# EAGLE schematic modular_expansion_system_graphics_and_sound (EAGLE 9.2.1)
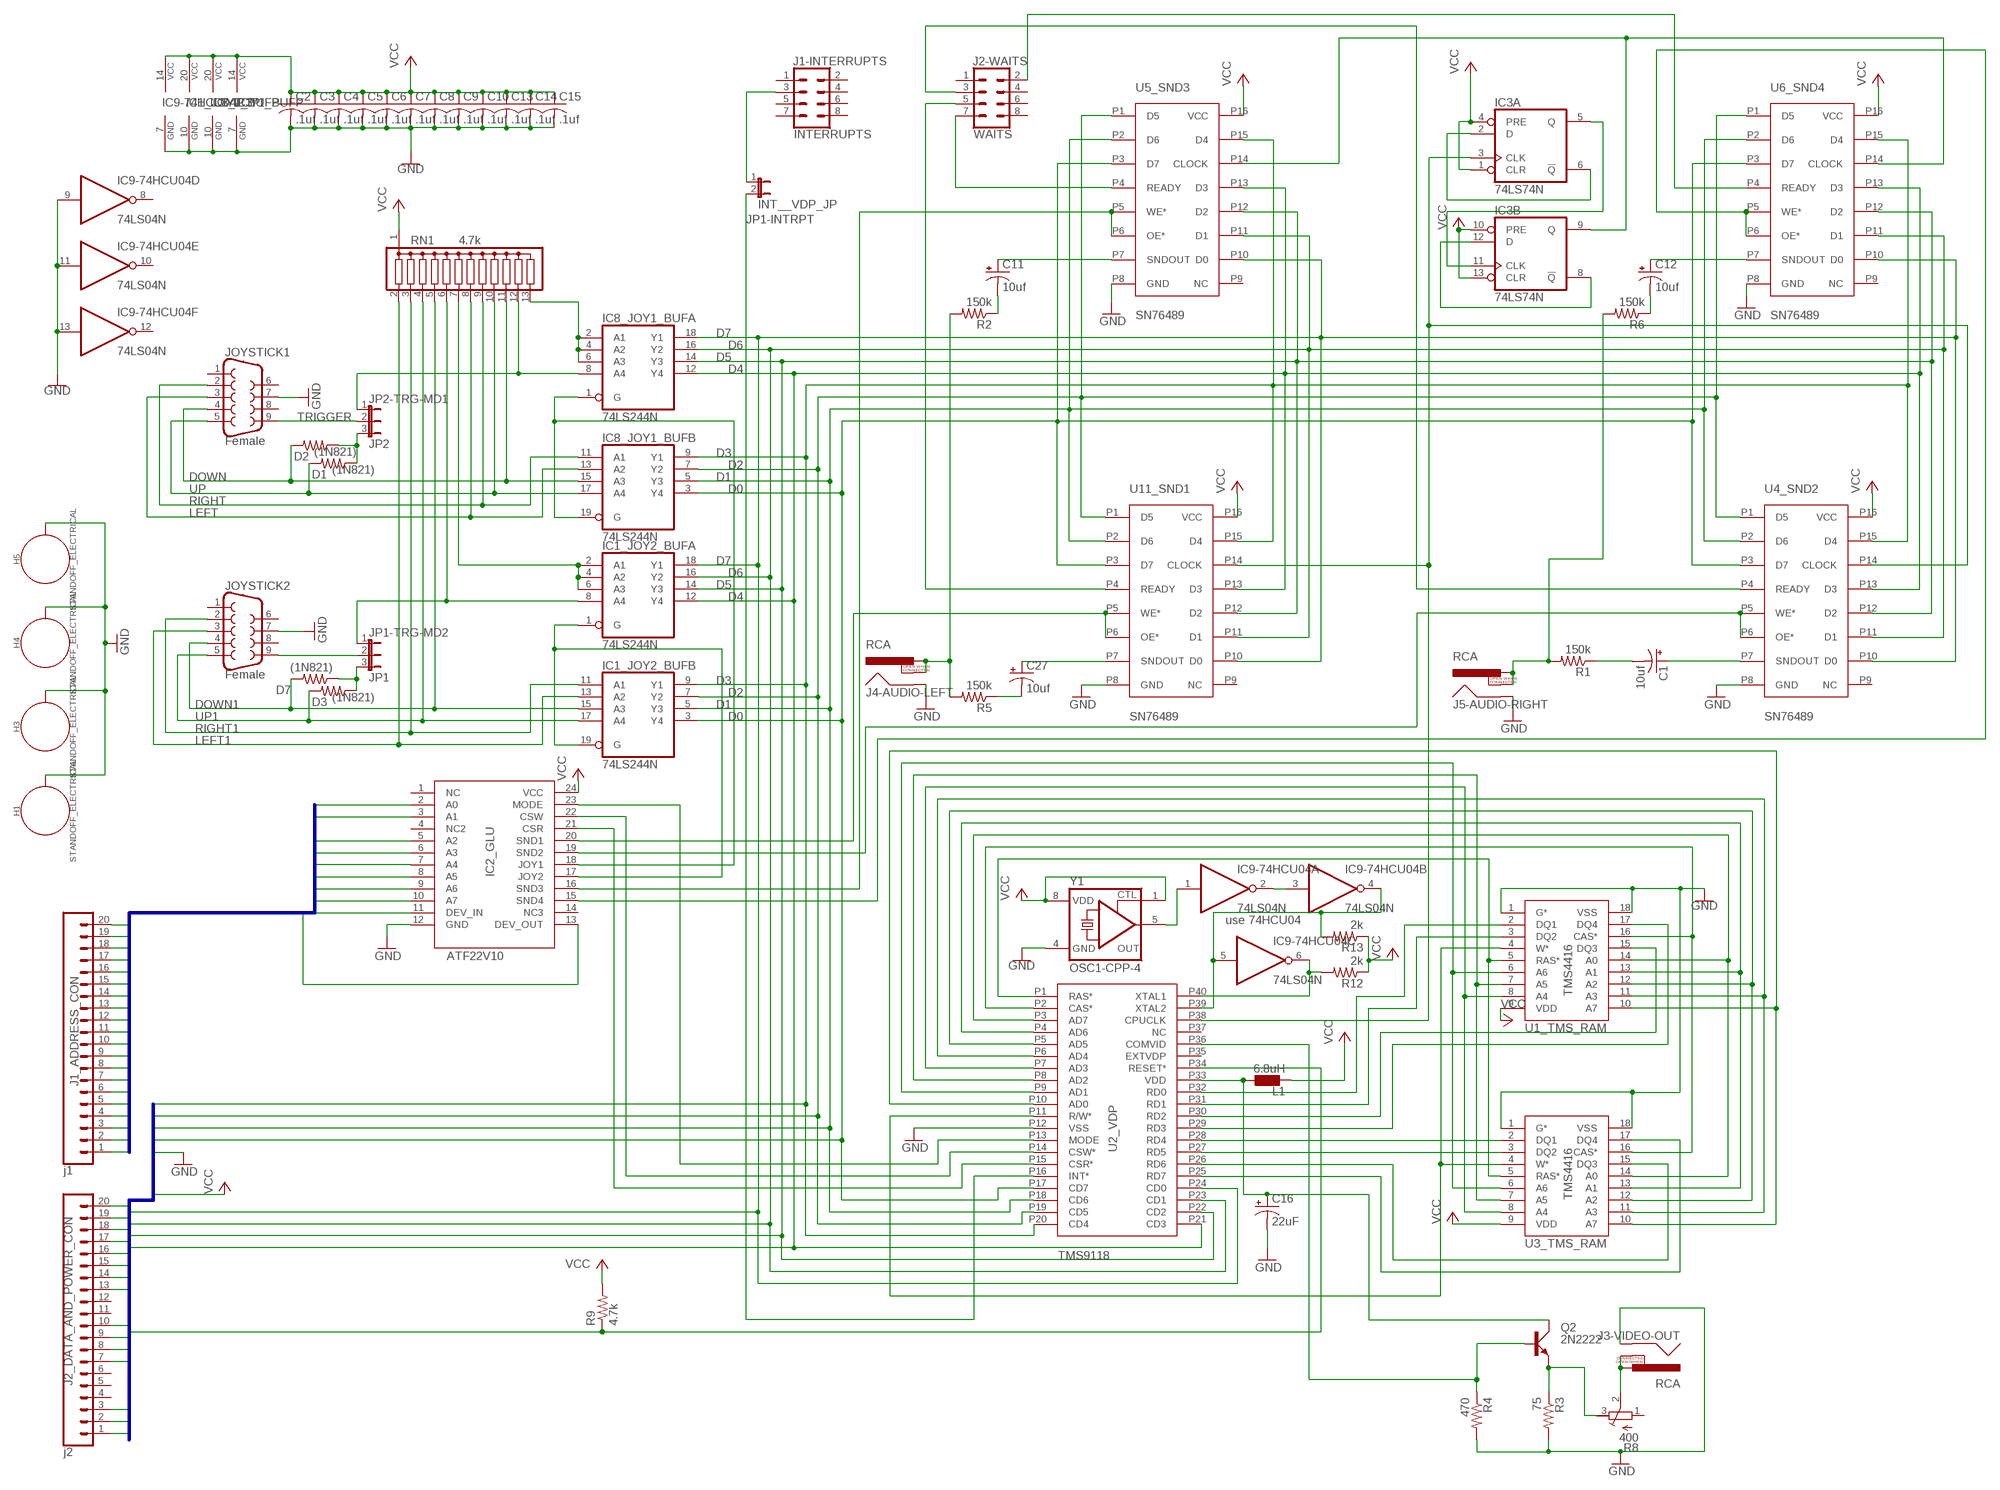
[diagram p0: schematic, sheet 1]

## Parts
C1  10uf  CPOL-USE2.5-6  [E2,5-6]
C2  .1uf  C-US025-024X044  [C025-024X044]
C3  .1uf  C-US025-024X044  [C025-024X044]
C4  .1uf  C-US025-024X044  [C025-024X044]
C5  .1uf  C-US025-024X044  [C025-024X044]
C6  .1uf  C-US025-024X044  [C025-024X044]
C7  .1uf  C-US025-024X044  [C025-024X044]
C8  .1uf  C-US025-024X044  [C025-024X044]
C9  .1uf  C-US025-024X044  [C025-024X044]
C10  .1uf  C-US025-024X044  [C025-024X044]
C11  10uf  CPOL-USE2.5-6  [E2,5-6]
C12  10uf  CPOL-USE2.5-6  [E2,5-6]
C13  .1uf  C-US025-024X044  [C025-024X044]
C14  .1uf  C-US025-024X044  [C025-024X044]
C15  .1uf  C-US025-024X044  [C025-024X044]
C16  22uF  CPOL-USE2.5-5  [E2,5-5]
C27  10uf  CPOL-USE2.5-6  [E2,5-6]
D1  (1N821)  R-US_0204/2V  [0204V]
D2  (1N821)  R-US_0204/2V  [0204V]
D3  (1N821)  R-US_0204/2V  [0204V]
D7  (1N821)  R-US_0204/2V  [0204V]
H1  STANDOFF_ELECTRICAL  [STANDOFF-ELECTRICAL]
H3  STANDOFF_ELECTRICAL  [STANDOFF-ELECTRICAL]
H4  STANDOFF_ELECTRICAL  [STANDOFF-ELECTRICAL]
H5  STANDOFF_ELECTRICAL  [STANDOFF-ELECTRICAL]
IC1_JOY2_BUF  74LS244N  [DIL20]
IC2_GLU  ATF22V10  TRS80MXS_DECODER  [DIP24SKI]
IC3  74LS74N  [DIL14]
IC8_JOY1_BUF  74LS244N  [DIL20]
IC9-74HCU04  74LS04N  [DIL14]
J1-INTERRUPTS  INTERRUPTS  CONN_04X2  [2X4]
J1_ADDRESS_CON  j1  CONN_20  [1X20]
J2-WAITS  WAITS  CONN_04X2  [2X4]
J2_DATA_AND_POWER_CON  j2  CONN_20  [1X20]
J3-VIDEO-OUT  RCA  [RCA]
J4-AUDIO-LEFT  RCA  [RCA]
J5-AUDIO-RIGHT  RCA  [RCA]
JOYSTICK1  Female  DB9FEMALE  [DB9]
JOYSTICK2  Female  DB9FEMALE  [DB9]
JP1-INTRPT  INT__VDP_JP  JP1E  [JP1]
JP1-TRG-MD2  JP1  JP2E  [JP2]
JP2-TRG-MD1  JP2  JP2E  [JP2]
L1  6.8uH  L0207/10  [0207/10]
Q2  2N2222  [TO18A]
R1  150k  R-US_0207/2V  [0207/2V]
R2  150k  R-US_0207/2V  [0207/2V]
R3  75  R-US_0207/2V  [0207/2V]
R4  470  R-US_0207/2V  [0207/2V]
R5  150k  R-US_0207/2V  [0207/2V]
R6  150k  R-US_0207/2V  [0207/2V]
R8  400  R-TRIMM64W  [RTRIM64W]
R9  4.7k  R-US_0207/2V  [0207/2V]
R12  2k  R-US_0207/2V  [0207/2V]
R13  2k  R-US_0207/2V  [0207/2V]
RN1  4.7k  G12R  [SIL13]
U1_TMS_RAM  TMS4416  [DIP18]
U2_VDP  TMS9118  [DIP40_MCU]
U3_TMS_RAM  TMS4416  [DIP18]
U4_SND2  SN76489  [DIP16]
U5_SND3  SN76489  [DIP16]
U6_SND4  SN76489  [DIP16]
U11_SND1  SN76489  [DIP16]
Y1  OSC1-CPP-4  [CPP-4]

## Nets
5_BIT_TRIGGER_LINE: IC8_JOY1_BUF.8(A:A4) JP2-TRG-MD1.1 RN1.12
5_BIT_TRIGGER_LINE_2: IC1_JOY2_BUF.8(A:A4) JP1-TRG-MD2.1 RN1.6
A0: IC2_GLU.2(A0) J1_ADDRESS_CON.1
A1: IC2_GLU.3(A1) J1_ADDRESS_CON.2
A2: IC2_GLU.5(A2) J1_ADDRESS_CON.3
A3: IC2_GLU.6(A3) J1_ADDRESS_CON.4
A4: IC2_GLU.7(A4) J1_ADDRESS_CON.5
A5: IC2_GLU.8(A5) J1_ADDRESS_CON.6
A6: IC2_GLU.9(A6) J1_ADDRESS_CON.7
A7: IC2_GLU.10(A7) J1_ADDRESS_CON.8
A8: J1_ADDRESS_CON.9
A9: J1_ADDRESS_CON.10
A10: J1_ADDRESS_CON.11
A11: J1_ADDRESS_CON.12
A12: J1_ADDRESS_CON.13
A13: J1_ADDRESS_CON.14
A14: J1_ADDRESS_CON.15
A15: J1_ADDRESS_CON.16
CAS*: J2_DATA_AND_POWER_CON.9
CLK-IN-1: IC9-74HCU04.6(C:O) R12.2 U2_VDP.P40(XTAL1)
CLK-IN-2: IC9-74HCU04.4(B:O) IC9-74HCU04.5(C:I) R13.2 U2_VDP.P39(XTAL2)
CLK-OUT: IC9-74HCU04.1(A:I) Y1.5(OUT)
CLOCK_DIV_4: IC3.9(B:Q) U5_SND3.P14(CLOCK) U6_SND4.P14(CLOCK)
COMVID: Q2.B R4.1 U2_VDP.P36(COMVID)
COMVID-OUT: Q2.E R3.1 R8.3(E)
CSR: IC2_GLU.21(CSR) U2_VDP.P15(CSR*)
CSW: IC2_GLU.22(CSW) U2_VDP.P14(CSW*)
D0: IC1_JOY2_BUF.3(B:Y4) IC8_JOY1_BUF.3(B:Y4) J2_DATA_AND_POWER_CON.20 U2_VDP.P17(CD7) U4_SND2.P3(D7) U5_SND3.P3(D7) U6_SND4.P3(D7) U11_SND1.P3(D7)
D1: IC1_JOY2_BUF.5(B:Y3) IC8_JOY1_BUF.5(B:Y3) J2_DATA_AND_POWER_CON.19 U2_VDP.P18(CD6) U4_SND2.P2(D6) U5_SND3.P2(D6) U6_SND4.P2(D6) U11_SND1.P2(D6)
D2: IC1_JOY2_BUF.7(B:Y2) IC8_JOY1_BUF.7(B:Y2) J2_DATA_AND_POWER_CON.18 U2_VDP.P19(CD5) U4_SND2.P1(D5) U5_SND3.P1(D5) U6_SND4.P1(D5) U11_SND1.P1(D5)
D3: IC1_JOY2_BUF.9(B:Y1) IC8_JOY1_BUF.9(B:Y1) J2_DATA_AND_POWER_CON.17 U2_VDP.P20(CD4) U4_SND2.P15(D4) U5_SND3.P15(D4) U6_SND4.P15(D4) U11_SND1.P15(D4)
D4: IC1_JOY2_BUF.12(A:Y4) IC8_JOY1_BUF.12(A:Y4) J2_DATA_AND_POWER_CON.16 U2_VDP.P21(CD3) U4_SND2.P13(D3) U5_SND3.P13(D3) U6_SND4.P13(D3) U11_SND1.P13(D3)
D5: IC1_JOY2_BUF.14(A:Y3) IC8_JOY1_BUF.14(A:Y3) J2_DATA_AND_POWER_CON.15 U2_VDP.P22(CD2) U4_SND2.P12(D2) U5_SND3.P12(D2) U6_SND4.P12(D2) U11_SND1.P12(D2)
D6: IC1_JOY2_BUF.16(A:Y2) IC8_JOY1_BUF.16(A:Y2) J2_DATA_AND_POWER_CON.14 U2_VDP.P23(CD1) U4_SND2.P11(D1) U5_SND3.P11(D1) U6_SND4.P11(D1) U11_SND1.P11(D1)
D7: IC1_JOY2_BUF.18(A:Y1) IC8_JOY1_BUF.18(A:Y1) J2_DATA_AND_POWER_CON.13 U2_VDP.P24(CD0) U4_SND2.P10(D0) U5_SND3.P10(D0) U6_SND4.P10(D0) U11_SND1.P10(D0)
DOWN: D2.2 IC8_JOY1_BUF.15(B:A3) JOYSTICK1.4 RN1.11
DOWN1: D7.2 IC1_JOY2_BUF.15(B:A3) JOYSTICK2.4 RN1.5
GND: C2.2 C3.2 C4.2 C5.2 C6.2 C7.2 C8.2 C9.2 C10.2 C13.2 C14.2 C15.2 C16.- H1.P1 H3.P1 H4.P1 H5.P1 IC1_JOY2_BUF.10(P:GND) IC2_GLU.12(GND) IC3.7(P:GND) IC8_JOY1_BUF.10(P:GND) IC9-74HCU04.7(P:GND) IC9-74HCU04.9(D:I) IC9-74HCU04.11(E:I) IC9-74HCU04.13(F:I) J2_DATA_AND_POWER_CON.2 J3-VIDEO-OUT.SHELL J4-AUDIO-LEFT.SHELL J5-AUDIO-RIGHT.SHELL JOYSTICK1.7 JOYSTICK2.7 R3.2 R4.2 U1_TMS_RAM.1(G*) U1_TMS_RAM.18(VSS) U2_VDP.P12(VSS) U3_TMS_RAM.1(G*) U3_TMS_RAM.18(VSS) U4_SND2.P8(GND) U5_SND3.P8(GND) U6_SND4.P8(GND) U11_SND1.P8(GND) Y1.4(GND)
IN*: IC2_GLU.11(DEV_IN) J1_ADDRESS_CON.17
INTAK*: J2_DATA_AND_POWER_CON.7
JOY1_IN_ENABLE_N: IC2_GLU.18(JOY1) IC8_JOY1_BUF.1(A:G) IC8_JOY1_BUF.19(B:G)
JOY2_IN_ENABLE_N: IC1_JOY2_BUF.1(A:G) IC1_JOY2_BUF.19(B:G) IC2_GLU.17(JOY2)
LEFT: IC8_JOY1_BUF.13(B:A2) JOYSTICK1.3 RN1.8
LEFT1: IC1_JOY2_BUF.13(B:A2) JOYSTICK2.3 RN1.2
N$1: J4-AUDIO-LEFT.PIN J4-AUDIO-LEFT.SWITCH R2.2 R5.2
N$2: J1-INTERRUPTS.3 JP1-INTRPT.1
N$3: JP1-INTRPT.2 U2_VDP.P16(INT*)
N$4: J3-VIDEO-OUT.PIN J3-VIDEO-OUT.SWITCH R8.2(S)
N$5: C12.- R6.1
N$6: IC3.5(A:Q) IC3.11(B:CLK)
N$7: IC3.8(B:!Q) IC3.12(B:D)
N$10: C11.+ U5_SND3.P7(SNDOUT)
N$12: IC9-74HCU04.2(A:O) IC9-74HCU04.3(B:I)
N$13: C12.+ U6_SND4.P7(SNDOUT)
N$14: IC3.2(A:D) IC3.6(A:!Q)
N$16: C1.- R1.1
N$17: C11.- R2.1
N$18: U1_TMS_RAM.5(RAS*) U2_VDP.P1(RAS*) U3_TMS_RAM.5(RAS*)
N$21: U1_TMS_RAM.16(CAS*) U2_VDP.P2(CAS*) U3_TMS_RAM.16(CAS*)
N$24: J5-AUDIO-RIGHT.PIN J5-AUDIO-RIGHT.SWITCH R1.2 R6.2
N$64: C27.- R5.1
OUT*: IC2_GLU.13(DEV_OUT) J1_ADDRESS_CON.18
RAS*: J2_DATA_AND_POWER_CON.10
RD*: J1_ADDRESS_CON.19
RIGHT: IC8_JOY1_BUF.11(B:A1) JOYSTICK1.2 RN1.9
RIGHT1: IC1_JOY2_BUF.11(B:A1) JOYSTICK2.2 RN1.3
SN76489-CLOCK: IC3.3(A:CLK) U2_VDP.P38(CPUCLK) U4_SND2.P14(CLOCK) U11_SND1.P14(CLOCK)
SND1_ENABLE_N: IC2_GLU.20(SND1) U11_SND1.P5(WE*) U11_SND1.P6(OE*)
SND1_READY: J2-WAITS.5 U11_SND1.P4(READY)
SND2_ENABLE_N: IC2_GLU.19(SND2) U4_SND2.P5(WE*) U4_SND2.P6(OE*)
SND2_READY: J2-WAITS.3 U4_SND2.P4(READY)
SND3_ENABLE_N: IC2_GLU.16(SND3) U5_SND3.P5(WE*) U5_SND3.P6(OE*)
SND3_READY: J2-WAITS.7 U5_SND3.P4(READY)
SND4_ENABLE_N: IC2_GLU.15(SND4) U6_SND4.P5(WE*) U6_SND4.P6(OE*)
SND4_READY: J2-WAITS.2 U6_SND4.P4(READY)
SNDOUT1: C27.+ U11_SND1.P7(SNDOUT)
SNDOUT2: C1.+ U4_SND2.P7(SNDOUT)
SYSRES*: J2_DATA_AND_POWER_CON.8 R9.1 U2_VDP.P34(RESET*)
TIED-HIGH-1: IC8_JOY1_BUF.2(A:A1) IC8_JOY1_BUF.4(A:A2) IC8_JOY1_BUF.6(A:A3) RN1.13
TIED-HIGH-2: IC1_JOY2_BUF.2(A:A1) IC1_JOY2_BUF.4(A:A2) IC1_JOY2_BUF.6(A:A3) RN1.7
TMS9118_RW(*)_TMS4416_W(*): U1_TMS_RAM.4(W*) U2_VDP.P11(R/W*) U3_TMS_RAM.4(W*)
TMS9918_AD0-TMS4416_A7: U1_TMS_RAM.10(A7) U2_VDP.P10(AD0) U3_TMS_RAM.10(A7)
TMS9918_AD1-TMS4416_A6: U1_TMS_RAM.6(A6) U2_VDP.P9(AD1) U3_TMS_RAM.6(A6)
TMS9918_AD2-TMS4416_A5: U1_TMS_RAM.7(A5) U2_VDP.P8(AD2) U3_TMS_RAM.7(A5)
TMS9918_AD3-TMS4416_A4: U1_TMS_RAM.8(A4) U2_VDP.P7(AD3) U3_TMS_RAM.8(A4)
TMS9918_AD4-TMS4416_A3: U1_TMS_RAM.11(A3) U2_VDP.P6(AD4) U3_TMS_RAM.11(A3)
TMS9918_AD5-TMS4416_A2: U1_TMS_RAM.12(A2) U2_VDP.P5(AD5) U3_TMS_RAM.12(A2)
TMS9918_AD6-TMS4416_A1: U1_TMS_RAM.13(A1) U2_VDP.P4(AD6) U3_TMS_RAM.13(A1)
TMS9918_AD7-TMS4416_A0: U1_TMS_RAM.14(A0) U2_VDP.P3(AD7) U3_TMS_RAM.14(A0)
TOPOFDIODES: D1.1 D2.1 JP2-TRG-MD1.3
TOPOFDIODES1: D3.1 D7.1 JP1-TRG-MD2.3
TRIGGER: JOYSTICK1.9 JP2-TRG-MD1.2
TRIGGER1: JOYSTICK2.9 JP1-TRG-MD2.2
UP: D1.2 IC8_JOY1_BUF.17(B:A4) JOYSTICK1.5 RN1.10
UP1: D3.2 IC1_JOY2_BUF.17(B:A4) JOYSTICK2.5 RN1.4
VCC: C2.1 C3.1 C4.1 C5.1 C6.1 C7.1 C8.1 C9.1 C10.1 C13.1 C14.1 C15.1 IC1_JOY2_BUF.20(P:VCC) IC2_GLU.24(VCC) IC3.1(A:CLR) IC3.4(A:PRE) IC3.10(B:PRE) IC3.13(B:CLR) IC3.14(P:VCC) IC8_JOY1_BUF.20(P:VCC) IC9-74HCU04.14(P:VCC) J2_DATA_AND_POWER_CON.1 L1.2 R9.2 R12.1 R13.1 RN1.1 U1_TMS_RAM.9(VDD) U3_TMS_RAM.9(VDD) U4_SND2.P16(VCC) U5_SND3.P16(VCC) U6_SND4.P16(VCC) U11_SND1.P16(VCC) Y1.1(CTL) Y1.8(VDD)
VCC/2: J2_DATA_AND_POWER_CON.3
VDP-RD0: U1_TMS_RAM.2(DQ1) U2_VDP.P32(RD0)
VDP-RD1: U1_TMS_RAM.3(DQ2) U2_VDP.P31(RD1)
VDP-RD2: U1_TMS_RAM.15(DQ3) U2_VDP.P30(RD2)
VDP-RD3: U1_TMS_RAM.17(DQ4) U2_VDP.P29(RD3)
VDP-RD4: U2_VDP.P28(RD4) U3_TMS_RAM.2(DQ1)
VDP-RD5: U2_VDP.P27(RD5) U3_TMS_RAM.3(DQ2)
VDP-RD6: U2_VDP.P26(RD6) U3_TMS_RAM.15(DQ3)
VDP-RD7: U2_VDP.P25(RD7) U3_TMS_RAM.17(DQ4)
VDP_MODE: IC2_GLU.23(MODE) U2_VDP.P13(MODE)
VID-VCC: C16.+ L1.1 Q2.C U2_VDP.P33(VDD)
WR*: J1_ADDRESS_CON.20
Unconnected: IC2_GLU.1(NC) IC2_GLU.4(NC2) IC2_GLU.14(NC3) IC9-74HCU04.8(D:O) IC9-74HCU04.10(E:O) IC9-74HCU04.12(F:O) J1-INTERRUPTS.1 J1-INTERRUPTS.2 J1-INTERRUPTS.4 J1-INTERRUPTS.5 J1-INTERRUPTS.6 J1-INTERRUPTS.7 J1-INTERRUPTS.8 J2-WAITS.1 J2-WAITS.4 J2-WAITS.6 J2-WAITS.8 J2_DATA_AND_POWER_CON.4 J2_DATA_AND_POWER_CON.5 J2_DATA_AND_POWER_CON.6 J2_DATA_AND_POWER_CON.11 J2_DATA_AND_POWER_CON.12 JOYSTICK1.1 JOYSTICK1.6 JOYSTICK1.8 JOYSTICK2.1 JOYSTICK2.6 JOYSTICK2.8 R8.1(A) U2_VDP.P35(EXTVDP) U2_VDP.P37(NC) U4_SND2.P9(NC) U5_SND3.P9(NC) U6_SND4.P9(NC) U11_SND1.P9(NC)

## Buses
ADDRESSBUS:A0,A1,A2,A3,A4,A5,A6,A7,A8,A9,A10,A11,A12,A13,A14,A15,IN*,OUT*,RD*,WR*
DATA_AND_POWER_BUS:CAS*,D0,D1,D2,D3,D4,D5,D6,D7,GND,INTAK*,RAS*,SYSRES*,VCC,VCC/2

## Notes on the sheet
- use 74HCU04

## Library data of the parts
C1 C11 C12 C16 C27 = resistor:CPOL-US: POLARIZED CAPACITOR, American symbol
C2-C10 C13-C15 = resistor:C-US: CAPACITOR, American symbol
D1-D3 D7 = rcl:R-US_: RESISTOR, American symbol; SPICEPREFIX: R
H1 H3-H5 = SparkFun-Hardware:STANDOFF_ELECTRICAL: Stand Off Drill holes with an electrical connection. For example, use these to ground your board to a chassis. Example SparkFun Products Screw - Phillips Head (1/4", 4-40, 10 pack) <https://www.sparkfun.com/products/10453> (PRT-10453) Screw - Phillips Head (1/2", 4-40, 10 pack) <https://www.sparkfun.com/products/10452> (PRT-10452) Screw - Phillips Head (3/4", 4-40, 10 pack) <https://www.sparkfun.com/products/10451> (PRT-10451) Screw - Phillips Head (1", 4-40, 10 pack) <https://www.sparkfun.com/products/10450> (PRT-10450)
IC1_JOY2_BUF IC8_JOY1_BUF = 74xx-us:74*244: Octal BUFFER and LINE DRIVER, 3-state
IC2_GLU = TMS99:TRS80MXS_DECODER: TRS80MXS - glue logic for TRS80MXS base board
IC3 = 74xx-us:74*74: Dual D type positive edge triggered FLIP FLOP, preset and clear
IC9-74HCU04 = 74xx-us:74*04: Hex INVERTER
J1-INTERRUPTS J2-WAITS = SparkFun-Connectors:CONN_04X2: Multi connection point. Often used as Generic Header-pin footprint for 0.1 inch spaced/style header connections On any of the 0.1 inch spaced packages, you can populate with these: Break Away Headers - Straight <https://www.sparkfun.com/products/116> (PRT-00116) Break Away Male Headers - Right Angle <https://www.sparkfun.com/products/553> (PRT-00553) Female Headers <https://www.sparkfun.com/products/115> (PRT-00115) Break Away Headers - Machine Pin <https://www.sparkfun.com/products/117> (PRT-00117) Break Away Female Headers - Swiss Machine Pin <https://www.sparkfun.com/products/743> (PRT-00743)
J1_ADDRESS_CON J2_DATA_AND_POWER_CON = SparkFun-Connectors:CONN_20: Multi connection point. Often used as Generic Header-pin footprint for 0.1 inch spaced/style header connections On any of the 0.1 inch spaced packages, you can populate with these: Break Away Headers - Straight <https://www.sparkfun.com/products/116> (PRT-00116) Break Away Male Headers - Right Angle <https://www.sparkfun.com/products/553> (PRT-00553) Female Headers <https://www.sparkfun.com/products/115> (PRT-00115) Break Away Headers - Machine Pin <https://www.sparkfun.com/products/117> (PRT-00117) Break Away Female Headers - Swiss Machine Pin <https://www.sparkfun.com/products/743> (PRT-00743) For SCREWTERMINALS and SPRING TERMINALS visit here: Screw Terimnals on SparkFun.com <https://www.sparkfun.com/search/results?term=Screw+Terminals> (5mm/3.5mm/2.54mm spacing) This device is also useful as a general connection point to wire up your design to another part of your project. Our various solder wires solder well into these plated through hole pads. Hook-Up Wire - Assortment (Stranded, 22 AWG) <https://www.sparkfun.com/products/11375> (PRT-11375) Hook-Up Wire - Assortment (Solid Core, 22 AWG) <https://www.sparkfun.com/products/11367> (PRT-11367) View the entire wire category on our website here <https://www.sparkfun.com/categories/141> Special notes: Molex polarized connector foot print use with SKU : PRT-08231 with associated crimp pins and housings. 1MM SMD Version SKU: PRT-10208 NOTES ON THE VARIANTS LOCK and LOCK_LONGPADS... This footprint was designed to help hold the alignment of a through-hole component (i.e. 6-pin header) while soldering it into place. You may notice that each hole has been shifted either up or down by 0.005 of an inch from it's more standard position (which is a perfectly straight line). This slight alteration caused the pins (the squares in the middle) to touch the edges of the holes. Because they are alternating, it causes a "brace" to hold the component in place. 0.005 has proven to be the perfect amount of "off-center" position when using our standard breakaway headers. Although looks a little odd when you look at the bare footprint, once you have a header in there, the alteration is very hard to notice. Also,if you push a header all the way into place, it is covered up entirely on the bottom side. Note about LOCK SPECIAL package: This is just like the LOCK variant in that the holes are staggared by 5 mil, but except for the last two holes. They are not altered from the "standard" footprint layout. This is used for a special purpose on the layout of our Graphic LCD Backpack. Make sure you want to use this device before selecting it for you project!
J3-VIDEO-OUT J4-AUDIO-LEFT J5-AUDIO-RIGHT = SparkFun-Connectors:RCA: RCA Jack connector This is a right angle RCA jack connecotr. Commonly used for video or audio. Here is the connector we sell at SparkFun: RCA Jack <https://www.sparkfun.com/products/8631> (PRT-08631) Datasheet <http://www.sparkfun.com/datasheets/Prototyping/Connectors/RCA-Jack.pdf> It is not used on any active designs, however it was used on a couple retired products: RCA Jack Breakout [RETIRED] <https://www.sparkfun.com/products/8826> (PRT-08826) SparkFun On Screen Display Breakout - MAX7456 [RETIRED] <https://www.sparkfun.com/products/9168> (BOB-09168) You may also be interested in a cable: RCA Video Cable - 6' <https://www.sparkfun.com/products/11573> (CAB-11573); PROD_ID: CONN-09081; SF_ID: PRT-08631
JOYSTICK1 JOYSTICK2 = SparkFun-Connectors:DB9: DB9 Connector Standard DB9 (D-Sub 9) serial connector. Can be used for CAN bus as well as RS485 and RS232. Footprint production proven. Here is the female version connector we sell at SparkFun: 9 Pin Female Serial Connector - PCB Mount <https://www.sparkfun.com/products/429> (PRT-00429) This connector has been used on the following SparkFun products: SparkFun RS232 Shifter - SMD <https://www.sparkfun.com/products/449> (PRT-00449) SparkFun RS232 Shifter SMD (No DB9) <https://www.sparkfun.com/products/8780> (PRT-08780); PROD_ID: CONN-08194
JP1-INTRPT = jumper:JP1E: JUMPER
JP1-TRG-MD2 JP2-TRG-MD1 = jumper:JP2E: JUMPER
L1 = eagle-ltspice:L: INDUCTOR, European symbol; SPICEMODEL: NONE; SPICEPREFIX: L
Q2 = transistor-small-signal:2N2222: NPN TRANSISTOR
R1-R6 R9 R12 R13 = resistor:R-US_: RESISTOR, American symbol
R8 = resistor:R-TRIMM: Trimm resistor
RN1 = resistor-sil:G12R: SIL RESISTOR; OC_FARNELL: unknown; OC_NEWARK: unknown
U1_TMS_RAM U3_TMS_RAM = TMS99:TMS4416: TMS4416
U2_VDP = TMS99:TMS9118: TMS9118
U4_SND2 U5_SND3 U6_SND4 U11_SND1 = TMS99:SN76489: SN76489 Sound Chip
Y1 = oscillators:OSC1-: OSCILLATOR

## Net classes
0 default: width 0.3 mm